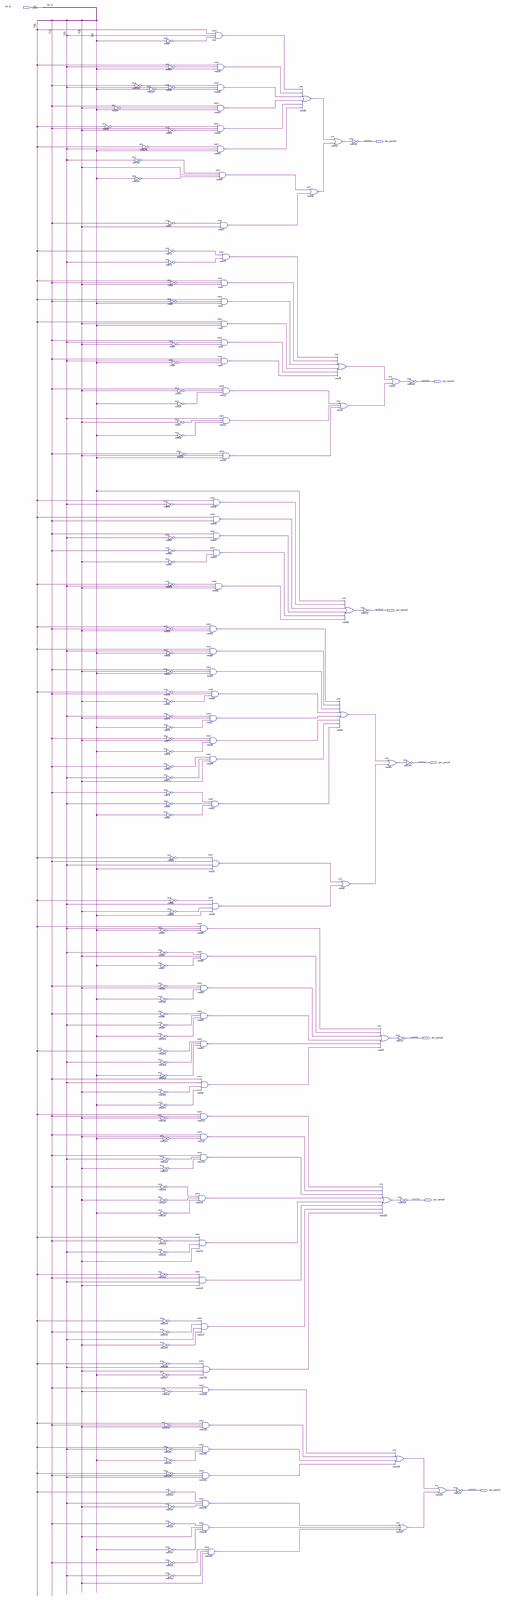
[diagram p0: schematic sheet, whole]
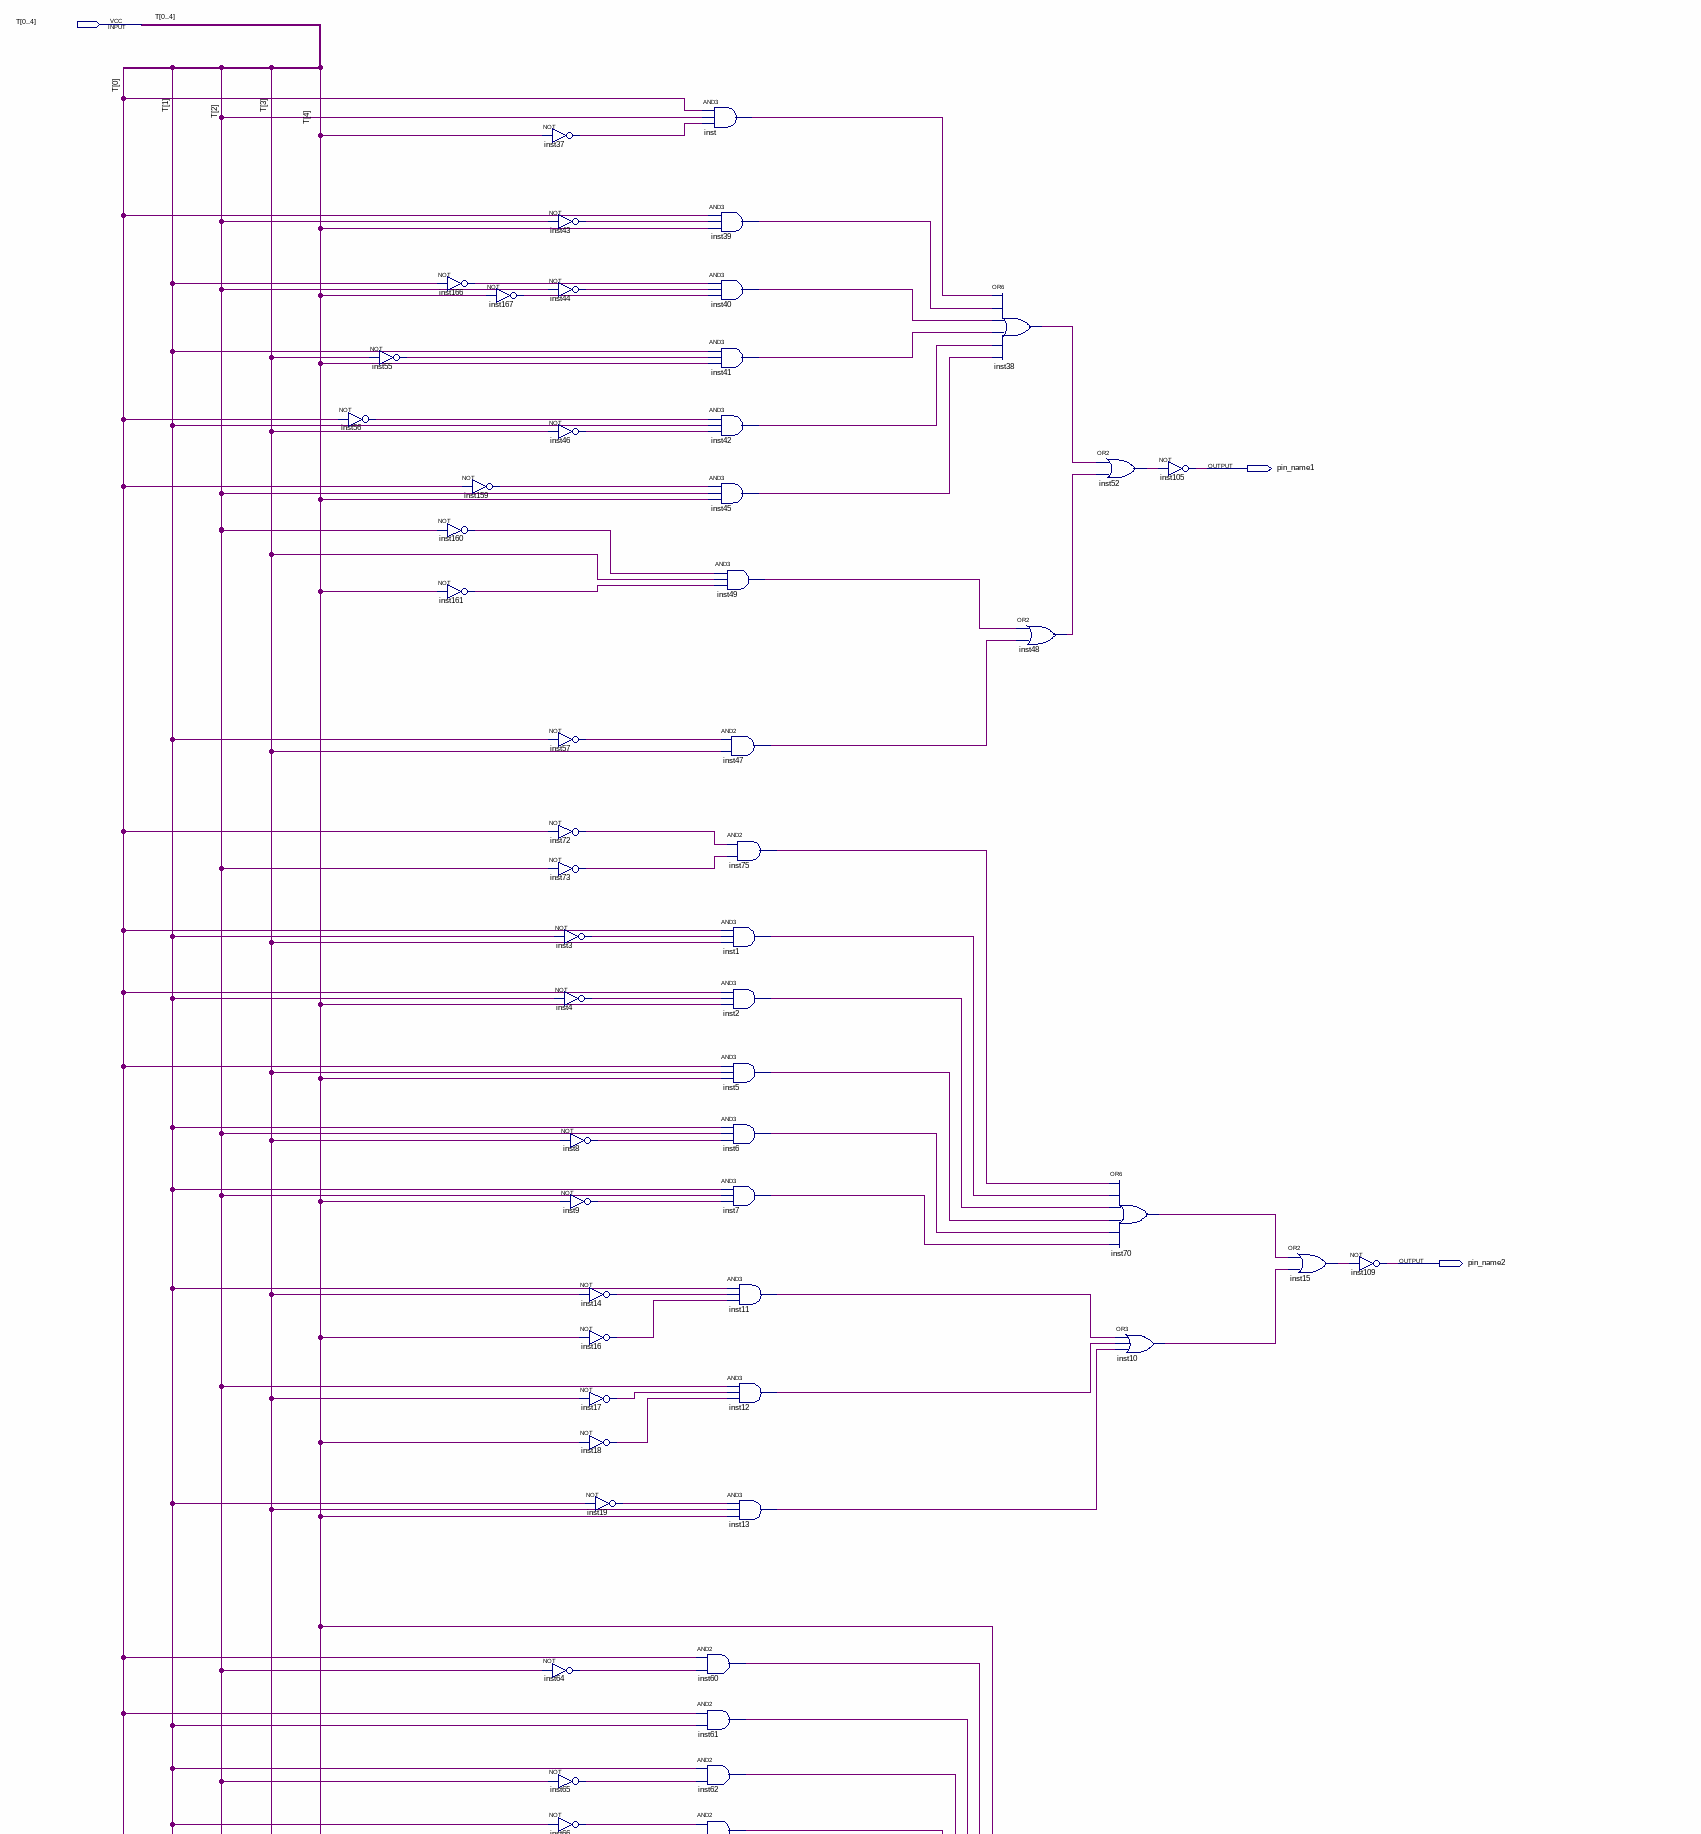
[diagram p1: schematic sheet, upper part]
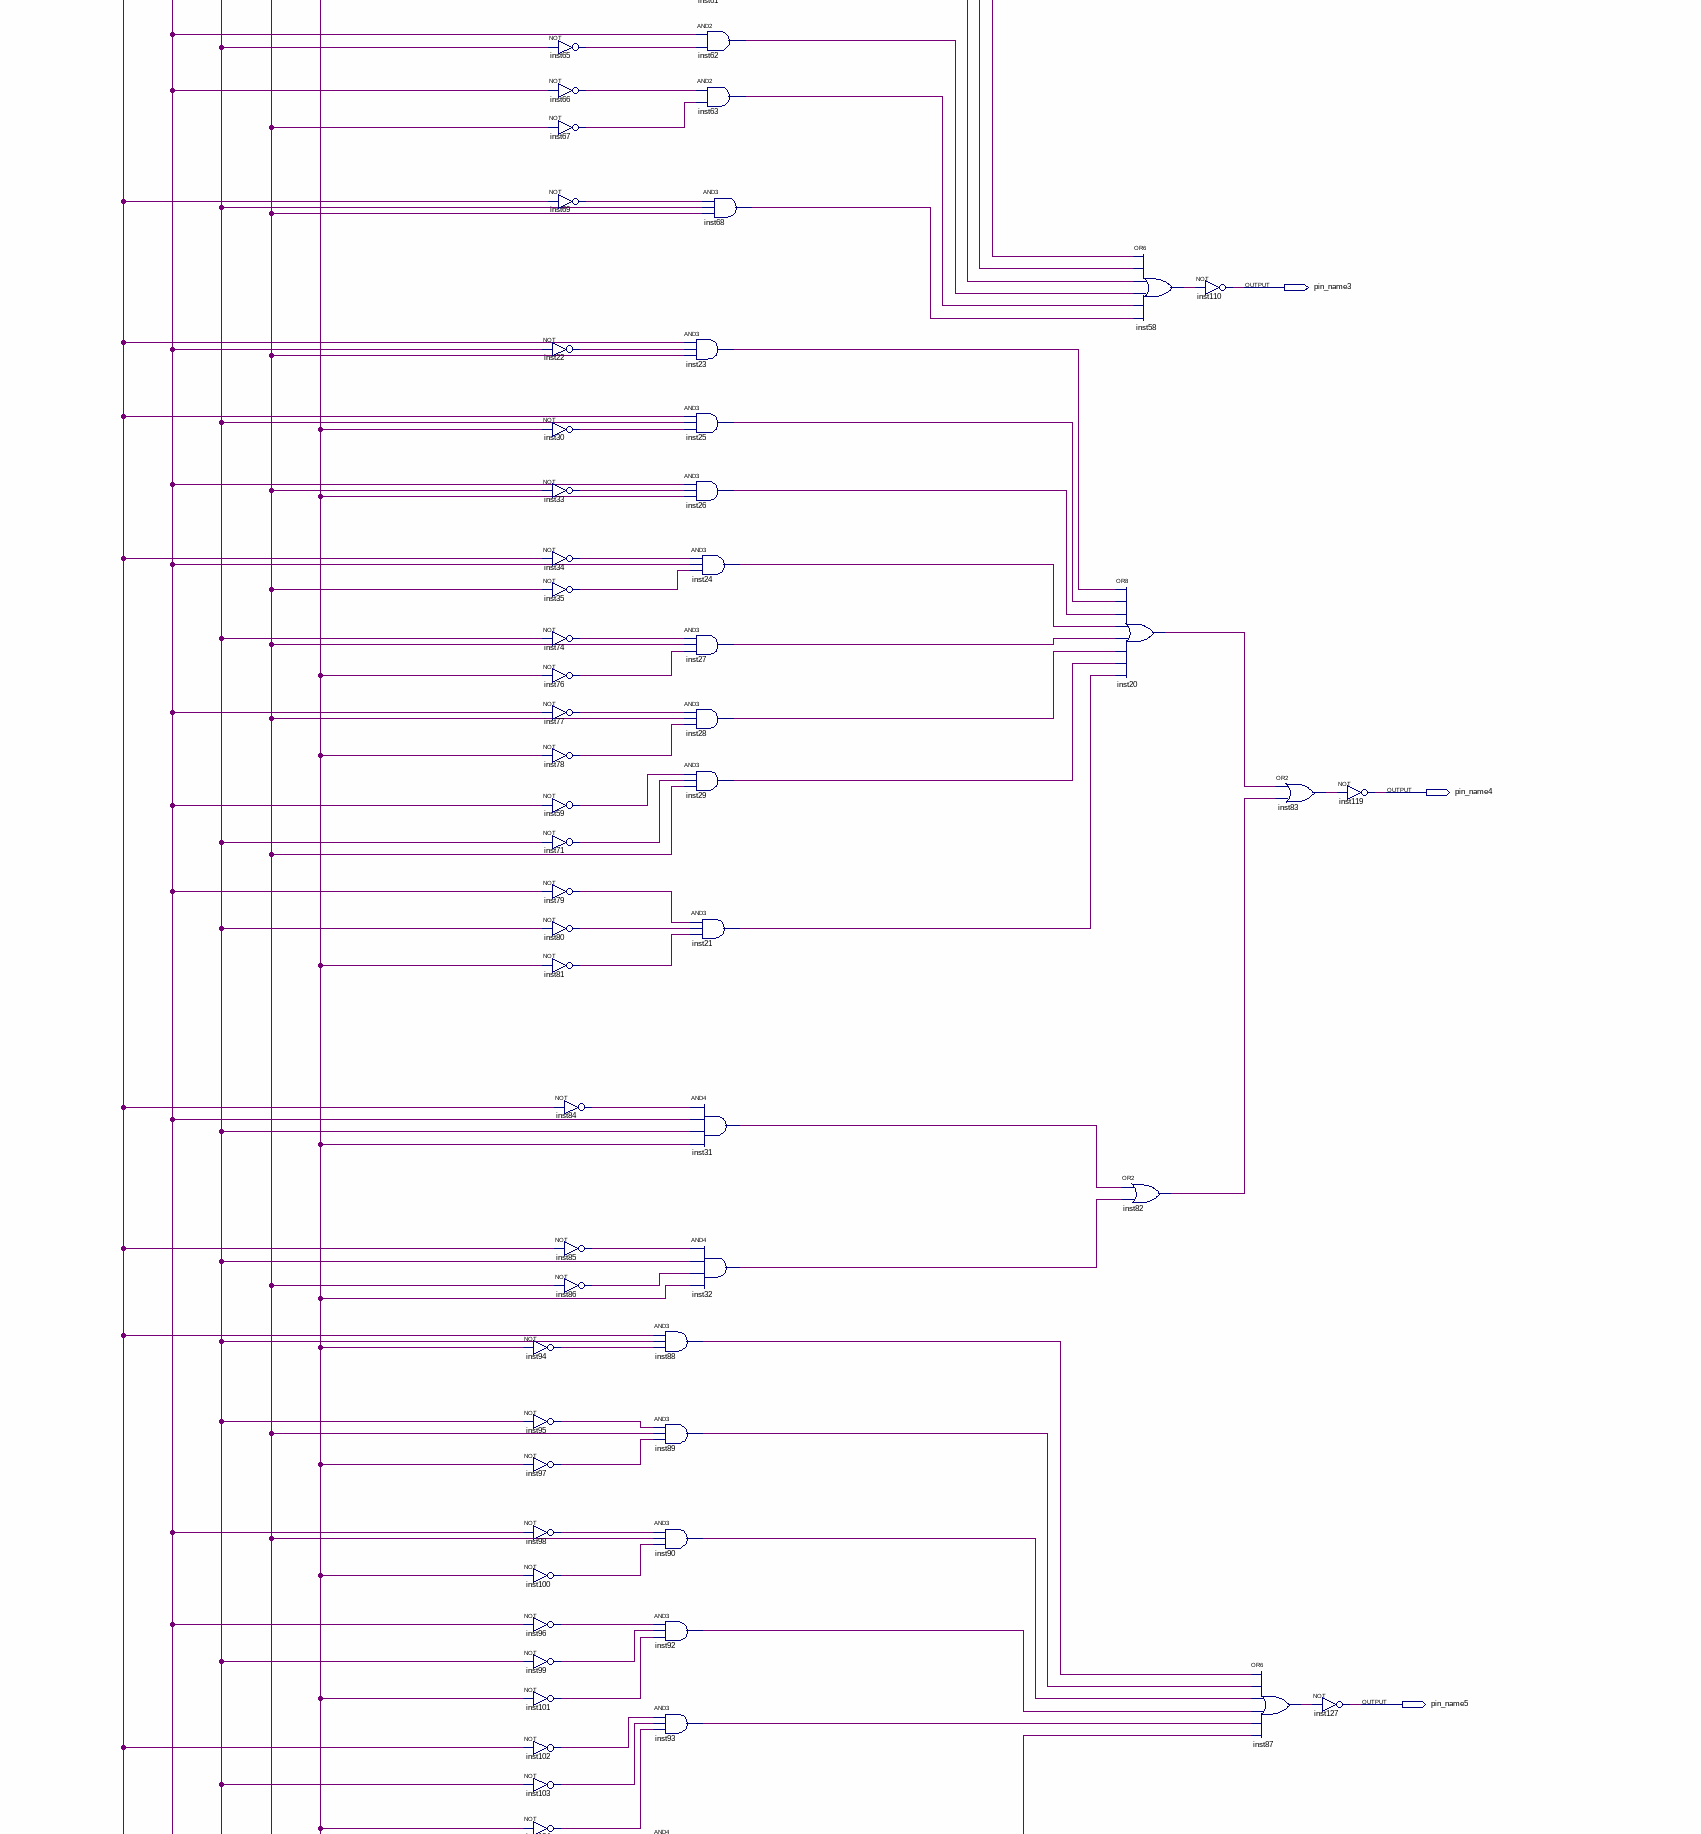
[diagram p2: schematic sheet, middle part]
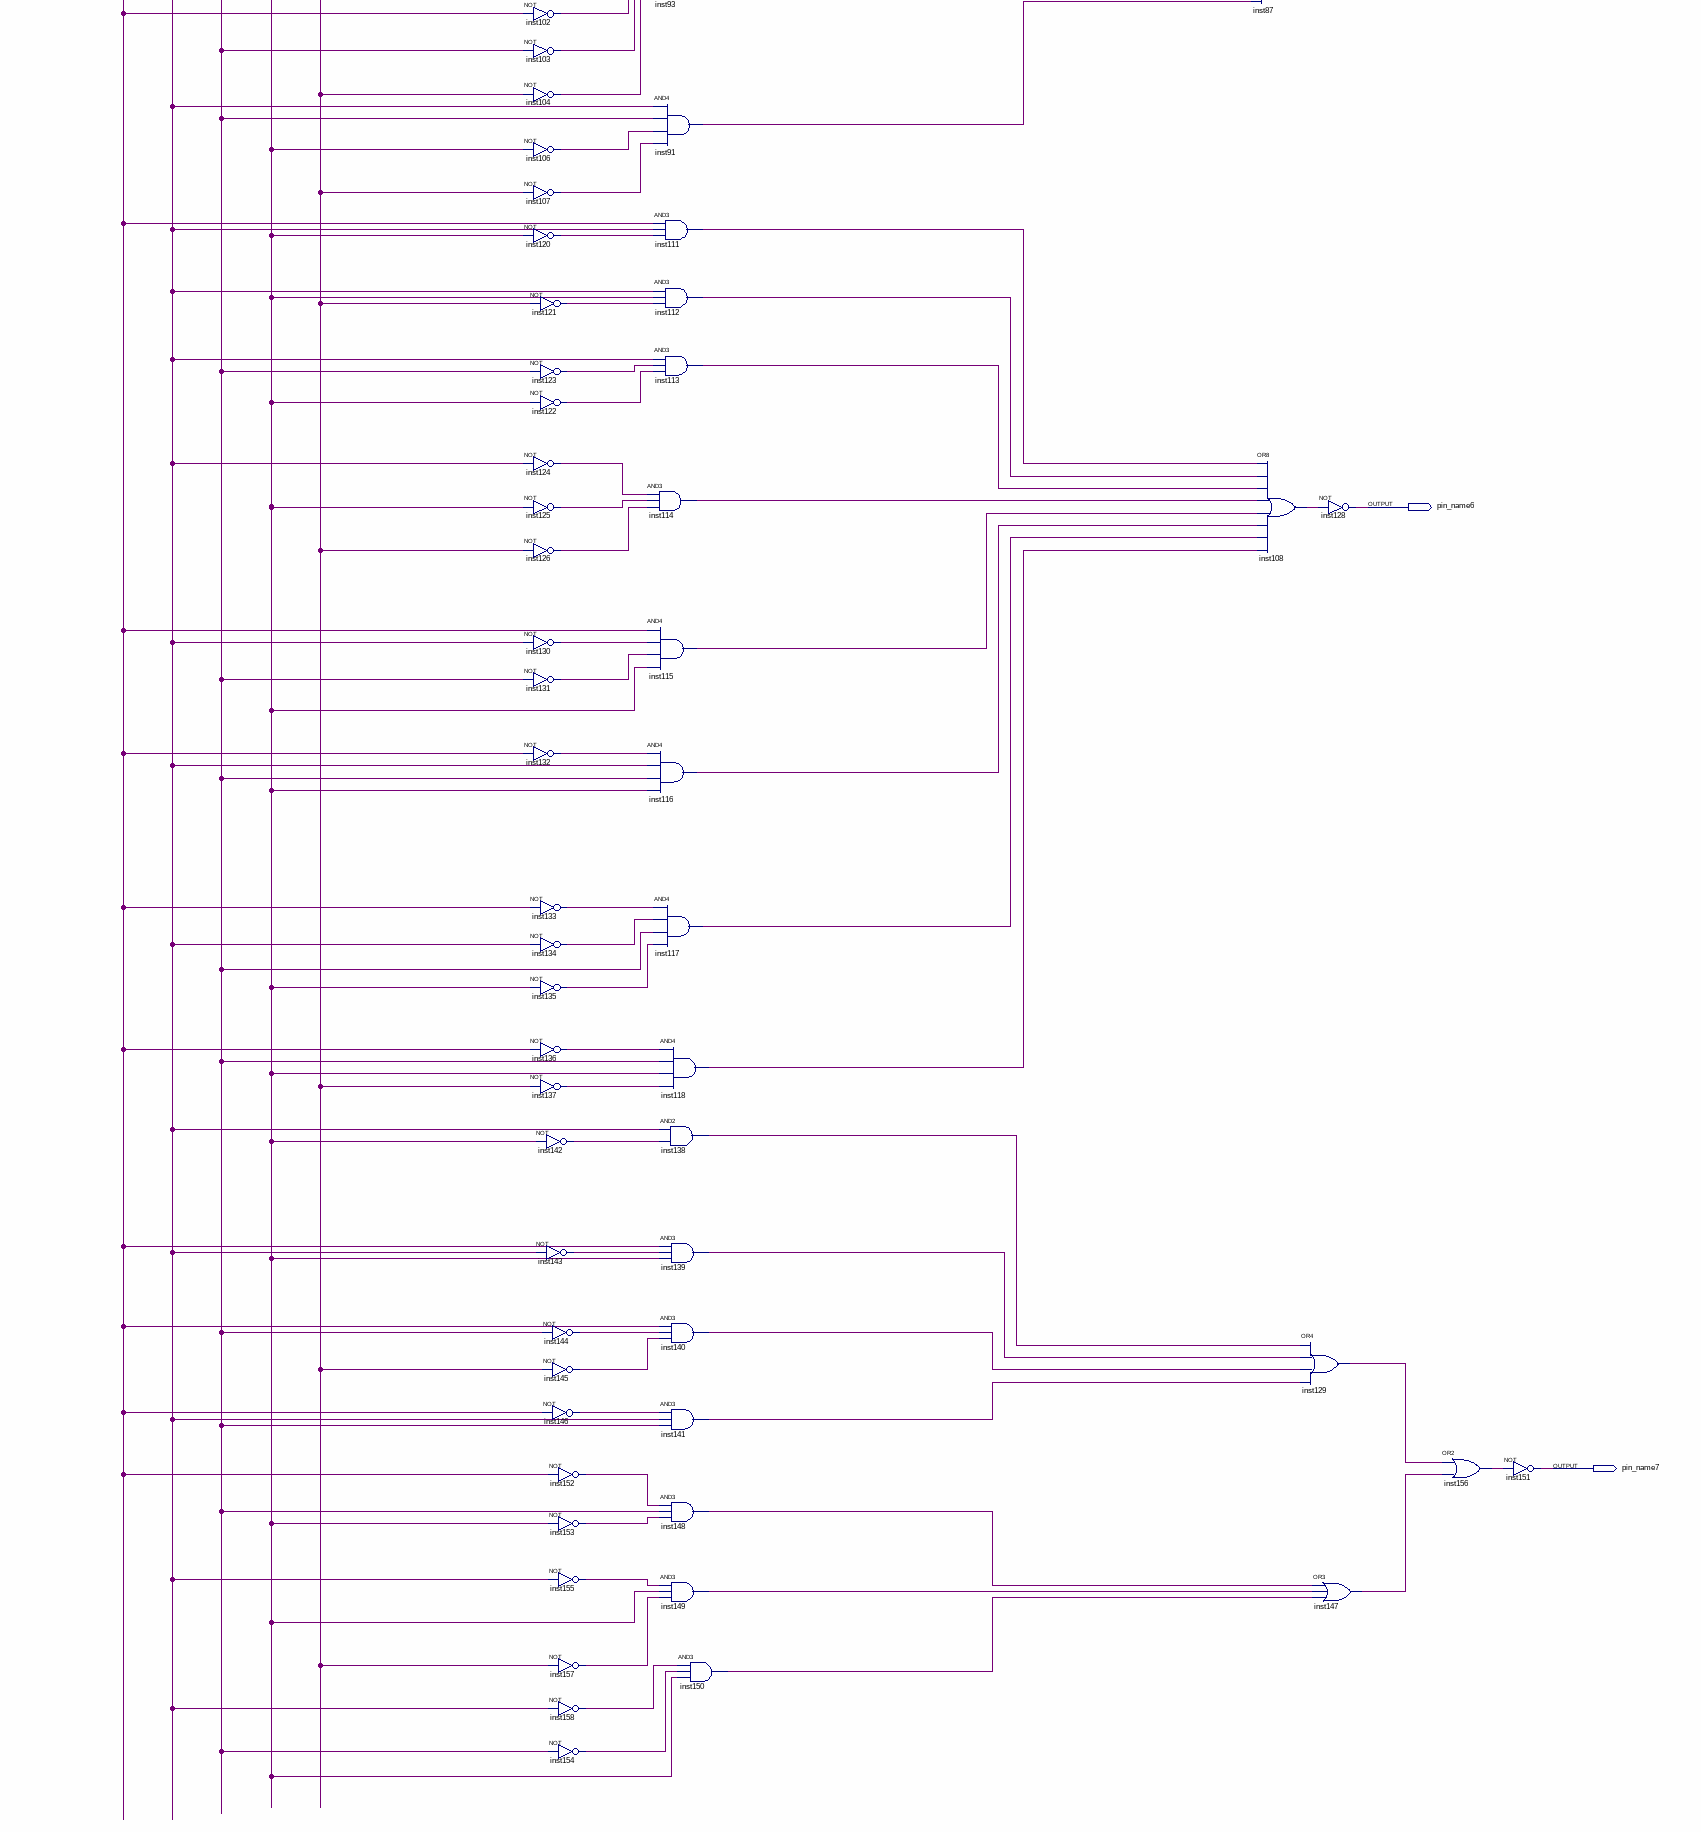
[diagram p3: schematic sheet, lower part]
// Quartus schematic display.bdf as structural Verilog: 159 symbols, 8 pins
module display (
  input  [0:4] T,
  output pin_name1,
  output pin_name2,
  output pin_name3,
  output pin_name4,
  output pin_name5,
  output pin_name6,
  output pin_name7
);

  wire inst1_out, inst2_out, inst3_out, inst4_out, inst5_out, inst6_out, inst7_out, inst8_out, inst9_out,
       inst10_out, inst11_out, inst12_out, inst13_out, inst14_out, inst15_out, inst16_out, inst17_out,
       inst18_out, inst19_out, inst20_out, inst21_out, inst22_out, inst23_out, inst24_out, inst25_out,
       inst26_out, inst27_out, inst28_out, inst29_out, inst30_out, inst31_out, inst32_out, inst33_out,
       inst34_out, inst35_out, inst37_out, inst38_out, inst39_out, inst40_out, inst41_out, inst42_out,
       inst43_out, inst44_out, inst45_out, inst46_out, inst47_out, inst48_out, inst49_out, inst52_out,
       inst55_out, inst56_out, inst57_out, inst58_out, inst59_out, inst60_out, inst61_out, inst62_out,
       inst63_out, inst64_out, inst65_out, inst66_out, inst67_out, inst68_out, inst69_out, inst70_out,
       inst71_out, inst72_out, inst73_out, inst74_out, inst75_out, inst76_out, inst77_out, inst78_out,
       inst79_out, inst80_out, inst81_out, inst82_out, inst83_out, inst84_out, inst85_out, inst86_out,
       inst87_out, inst88_out, inst89_out, inst90_out, inst91_out, inst92_out, inst93_out, inst94_out,
       inst95_out, inst96_out, inst97_out, inst98_out, inst99_out, inst100_out, inst101_out, inst102_out,
       inst103_out, inst104_out, inst106_out, inst107_out, inst108_out, inst111_out, inst112_out,
       inst113_out, inst114_out, inst115_out, inst116_out, inst117_out, inst118_out, inst120_out,
       inst121_out, inst122_out, inst123_out, inst124_out, inst125_out, inst126_out, inst129_out,
       inst130_out, inst131_out, inst132_out, inst133_out, inst134_out, inst135_out, inst136_out,
       inst137_out, inst138_out, inst139_out, inst140_out, inst141_out, inst142_out, inst143_out,
       inst144_out, inst145_out, inst146_out, inst147_out, inst148_out, inst149_out, inst150_out,
       inst152_out, inst153_out, inst154_out, inst155_out, inst156_out, inst157_out, inst158_out,
       inst159_out, inst160_out, inst161_out, inst166_out, inst167_out, inst_out;

  not inst55 (inst55_out, T[3]);
  not inst56 (inst56_out, T[0]);
  not inst166 (inst166_out, T[1]);
  not inst159 (inst159_out, T[0]);
  not inst160 (inst160_out, T[2]);
  not inst161 (inst161_out, T[4]);
  not inst167 (inst167_out, T[4]);
  not inst94 (inst94_out, T[4]);
  not inst95 (inst95_out, T[2]);
  not inst97 (inst97_out, T[4]);
  not inst98 (inst98_out, T[1]);
  not inst100 (inst100_out, T[4]);
  not inst96 (inst96_out, T[1]);
  not inst99 (inst99_out, T[2]);
  not inst101 (inst101_out, T[4]);
  not inst102 (inst102_out, T[0]);
  not inst103 (inst103_out, T[2]);
  not inst104 (inst104_out, T[4]);
  not inst106 (inst106_out, T[3]);
  not inst107 (inst107_out, T[4]);
  not inst120 (inst120_out, T[3]);
  not inst124 (inst124_out, T[1]);
  not inst125 (inst125_out, T[3]);
  not inst126 (inst126_out, T[4]);
  not inst130 (inst130_out, T[1]);
  not inst131 (inst131_out, T[2]);
  not inst132 (inst132_out, T[0]);
  not inst37 (inst37_out, T[4]);
  not inst43 (inst43_out, T[2]);
  not inst44 (inst44_out, T[2]);
  not inst46 (inst46_out, T[3]);
  not inst57 (inst57_out, T[1]);
  not inst72 (inst72_out, T[0]);
  not inst73 (inst73_out, T[2]);
  not inst3 (inst3_out, T[1]);
  not inst4 (inst4_out, T[1]);
  not inst8 (inst8_out, T[3]);
  not inst9 (inst9_out, T[4]);
  not inst64 (inst64_out, T[2]);
  not inst65 (inst65_out, T[2]);
  not inst66 (inst66_out, T[1]);
  not inst67 (inst67_out, T[3]);
  not inst69 (inst69_out, T[0]);
  not inst22 (inst22_out, T[1]);
  not inst30 (inst30_out, T[4]);
  not inst33 (inst33_out, T[3]);
  not inst34 (inst34_out, T[0]);
  not inst35 (inst35_out, T[3]);
  not inst74 (inst74_out, T[2]);
  not inst76 (inst76_out, T[4]);
  not inst77 (inst77_out, T[1]);
  not inst78 (inst78_out, T[4]);
  not inst59 (inst59_out, T[1]);
  not inst71 (inst71_out, T[2]);
  not inst79 (inst79_out, T[1]);
  not inst80 (inst80_out, T[2]);
  not inst81 (inst81_out, T[4]);
  not inst84 (inst84_out, T[0]);
  not inst85 (inst85_out, T[0]);
  not inst86 (inst86_out, T[3]);
  not inst121 (inst121_out, T[4]);
  not inst123 (inst123_out, T[2]);
  not inst122 (inst122_out, T[3]);
  not inst133 (inst133_out, T[0]);
  not inst134 (inst134_out, T[1]);
  not inst135 (inst135_out, T[3]);
  not inst136 (inst136_out, T[0]);
  not inst137 (inst137_out, T[4]);
  not inst142 (inst142_out, T[3]);
  not inst143 (inst143_out, T[1]);
  not inst144 (inst144_out, T[2]);
  not inst145 (inst145_out, T[4]);
  not inst146 (inst146_out, T[0]);
  not inst152 (inst152_out, T[0]);
  not inst153 (inst153_out, T[3]);
  not inst155 (inst155_out, T[1]);
  not inst157 (inst157_out, T[4]);
  not inst158 (inst158_out, T[1]);
  not inst154 (inst154_out, T[2]);
  not inst14 (inst14_out, T[3]);
  not inst16 (inst16_out, T[4]);
  not inst17 (inst17_out, T[3]);
  not inst18 (inst18_out, T[4]);
  not inst19 (inst19_out, T[1]);
  and inst88 (inst88_out, T[0], T[2], inst94_out);
  and inst89 (inst89_out, inst95_out, T[3], inst97_out);
  and inst90 (inst90_out, inst98_out, T[3], inst100_out);
  and inst92 (inst92_out, inst96_out, inst99_out, inst101_out);
  and inst93 (inst93_out, inst102_out, inst103_out, inst104_out);
  and inst91 (inst91_out, T[1], T[2], inst106_out, inst107_out);
  and inst111 (inst111_out, T[0], T[1], inst120_out);
  and inst112 (inst112_out, T[1], T[3], inst121_out);
  and inst113 (inst113_out, T[1], inst123_out, inst122_out);
  and inst114 (inst114_out, inst124_out, inst125_out, inst126_out);
  and inst115 (inst115_out, T[0], inst130_out, inst131_out, T[3]);
  and inst116 (inst116_out, inst132_out, T[1], T[2], T[3]);
  and inst117 (inst117_out, inst133_out, inst134_out, T[2], inst135_out);
  and inst118 (inst118_out, inst136_out, T[2], T[3], inst137_out);
  and inst138 (inst138_out, T[1], inst142_out);
  and inst139 (inst139_out, T[0], inst143_out, T[3]);
  and inst140 (inst140_out, T[0], inst144_out, inst145_out);
  and inst141 (inst141_out, inst146_out, T[1], T[2]);
  and inst148 (inst148_out, inst152_out, T[2], inst153_out);
  and inst149 (inst149_out, inst155_out, T[3], inst157_out);
  and inst (inst_out, T[0], T[2], inst37_out);
  and inst39 (inst39_out, T[0], inst43_out, T[4]);
  and inst40 (inst40_out, inst166_out, inst44_out, inst167_out);
  and inst41 (inst41_out, T[1], inst55_out, T[4]);
  and inst42 (inst42_out, inst56_out, T[1], inst46_out);
  and inst45 (inst45_out, inst159_out, T[2], T[4]);
  and inst49 (inst49_out, inst160_out, T[3], inst161_out);
  and inst47 (inst47_out, inst57_out, T[3]);
  and inst1 (inst1_out, T[0], inst3_out, T[3]);
  and inst2 (inst2_out, T[0], inst4_out, T[4]);
  and inst5 (inst5_out, T[0], T[3], T[4]);
  and inst6 (inst6_out, T[1], T[2], inst8_out);
  and inst7 (inst7_out, T[1], T[2], inst9_out);
  and inst60 (inst60_out, T[0], inst64_out);
  and inst61 (inst61_out, T[0], T[1]);
  and inst62 (inst62_out, T[1], inst65_out);
  and inst63 (inst63_out, inst66_out, inst67_out);
  and inst68 (inst68_out, inst69_out, T[2], T[3]);
  and inst23 (inst23_out, T[0], inst22_out, T[3]);
  and inst25 (inst25_out, T[0], T[2], inst30_out);
  and inst26 (inst26_out, T[1], inst33_out, T[4]);
  and inst24 (inst24_out, inst34_out, T[1], inst35_out);
  and inst27 (inst27_out, inst74_out, T[3], inst76_out);
  and inst28 (inst28_out, inst77_out, T[3], inst78_out);
  and inst29 (inst29_out, inst59_out, inst71_out, T[3]);
  and inst21 (inst21_out, inst79_out, inst80_out, inst81_out);
  and inst31 (inst31_out, inst84_out, T[1], T[2], T[4]);
  and inst32 (inst32_out, inst85_out, T[2], inst86_out, T[4]);
  and inst150 (inst150_out, inst158_out, inst154_out, T[3]);
  and inst75 (inst75_out, inst72_out, inst73_out);
  and inst11 (inst11_out, T[1], inst14_out, inst16_out);
  and inst12 (inst12_out, T[2], inst17_out, inst18_out);
  and inst13 (inst13_out, inst19_out, T[3], T[4]);
  or inst38 (inst38_out, inst_out, inst39_out, inst40_out, inst41_out, inst42_out, inst45_out);
  or inst48 (inst48_out, inst49_out, inst47_out);
  or inst52 (inst52_out, inst38_out, inst48_out);
  or inst70 (inst70_out, inst75_out, inst1_out, inst2_out, inst5_out, inst6_out, inst7_out);
  or inst10 (inst10_out, inst11_out, inst12_out, inst13_out);
  or inst20 (inst20_out, inst23_out, inst25_out, inst26_out, inst24_out, inst27_out, inst28_out, inst29_out, inst21_out);
  not inst105 (pin_name1, inst52_out);
  or inst58 (inst58_out, T[4], inst60_out, inst61_out, inst62_out, inst63_out, inst68_out);
  or inst82 (inst82_out, inst31_out, inst32_out);
  not inst110 (pin_name3, inst58_out);
  or inst87 (inst87_out, inst88_out, inst89_out, inst90_out, inst92_out, inst93_out, inst91_out);
  or inst108 (inst108_out, inst111_out, inst112_out, inst113_out, inst114_out, inst115_out, inst116_out, inst117_out, inst118_out);
  or inst15 (inst15_out, inst70_out, inst10_out);
  or inst83 (inst83_out, inst20_out, inst82_out);
  not inst127 (pin_name5, inst87_out);
  or inst129 (inst129_out, inst138_out, inst139_out, inst140_out, inst141_out);
  or inst147 (inst147_out, inst148_out, inst149_out, inst150_out);
  not inst109 (pin_name2, inst15_out);
  not inst119 (pin_name4, inst83_out);
  not inst128 (pin_name6, inst108_out);
  or inst156 (inst156_out, inst129_out, inst147_out);
  not inst151 (pin_name7, inst156_out);
endmodule
